# Altium project Headlight PCB.PrjPcb
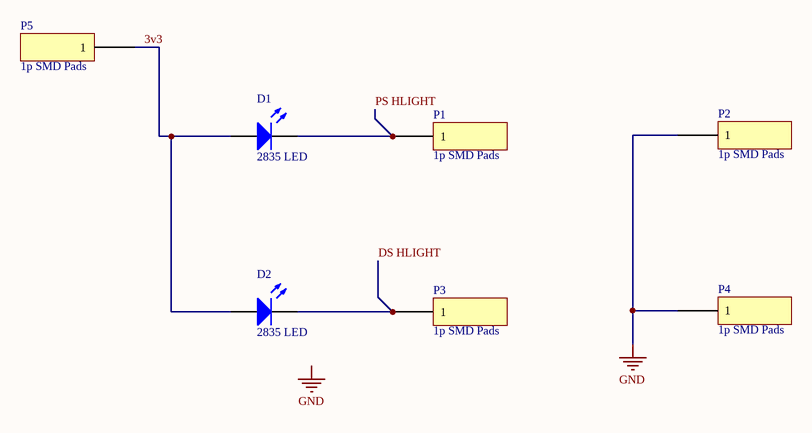
[diagram p0: Lights.SchDoc]
projecttitle: DC2019 CHV Badge Headlight; projectrevision: 2
1 sheet, 7 parts. Net scope: global (net labels, ports and power ports of the same name join across sheets).
Board file: Headlight PCB.PcbDoc

## Sheet Lights.SchDoc
size Letter

### Parts
D1  2835 LED  [2835 LED]
D2  2835 LED  [2835 LED]
P1  1p SMD Pads  [1p SMD pad]
P2  1p SMD Pads  [1p SMD pad]
P3  1p SMD Pads  [1p SMD pad]
P4  1p SMD Pads  [1p SMD pad]
P5  1p SMD Pads  [1p SMD pad]

### Nets
GND: P2.1 P4.1
3v3: D1.1(A) D2.1(A) P5.1
DS HLIGHT: D2.2(K) P3.1
PS HLIGHT: D1.2(K) P1.1

### Notes on the sheet
- Labels drawn without touching a wire or pin: GND
- Title
- Size:
- Date:
- Letter
- Number:
- Time:
- Revision:
- Sheet
- of
- Copyright 2019
- Specialized Solutions LLC
- 206 W Lincoln Hwy STE B
- New Haven, IN 46774
- www.specsolns.com <http://www.specsolns.com>
- File:

### Library data of the parts
D1 D2 = 2835 LED: White LED Songxin Light
P1-P5 = 1p SMD